# Altium schematic sheet CH555-R0-1v0.SchDoc
size 889 x 635 mm
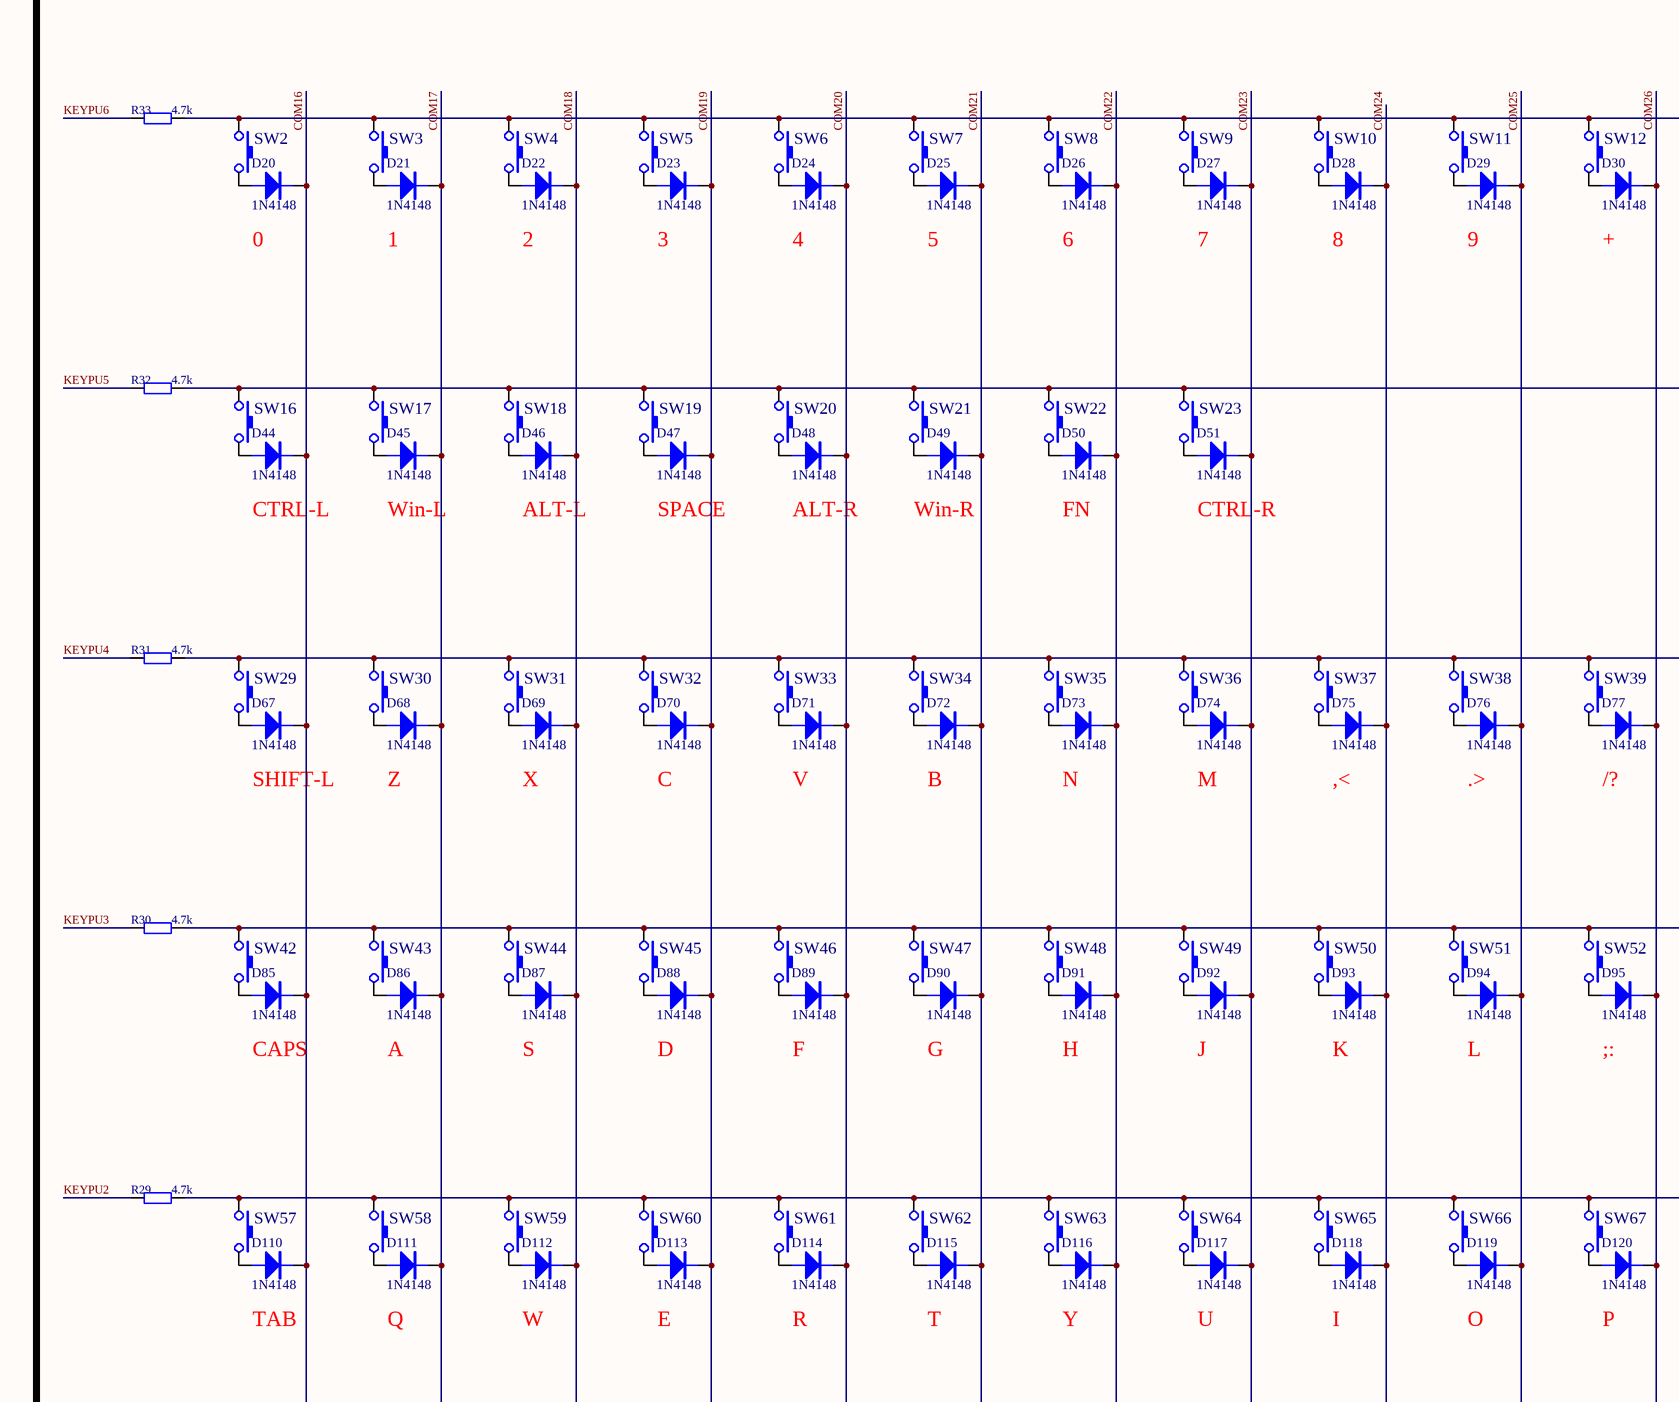
[diagram p0: CH555-R0-1v0.SchDoc, top left]
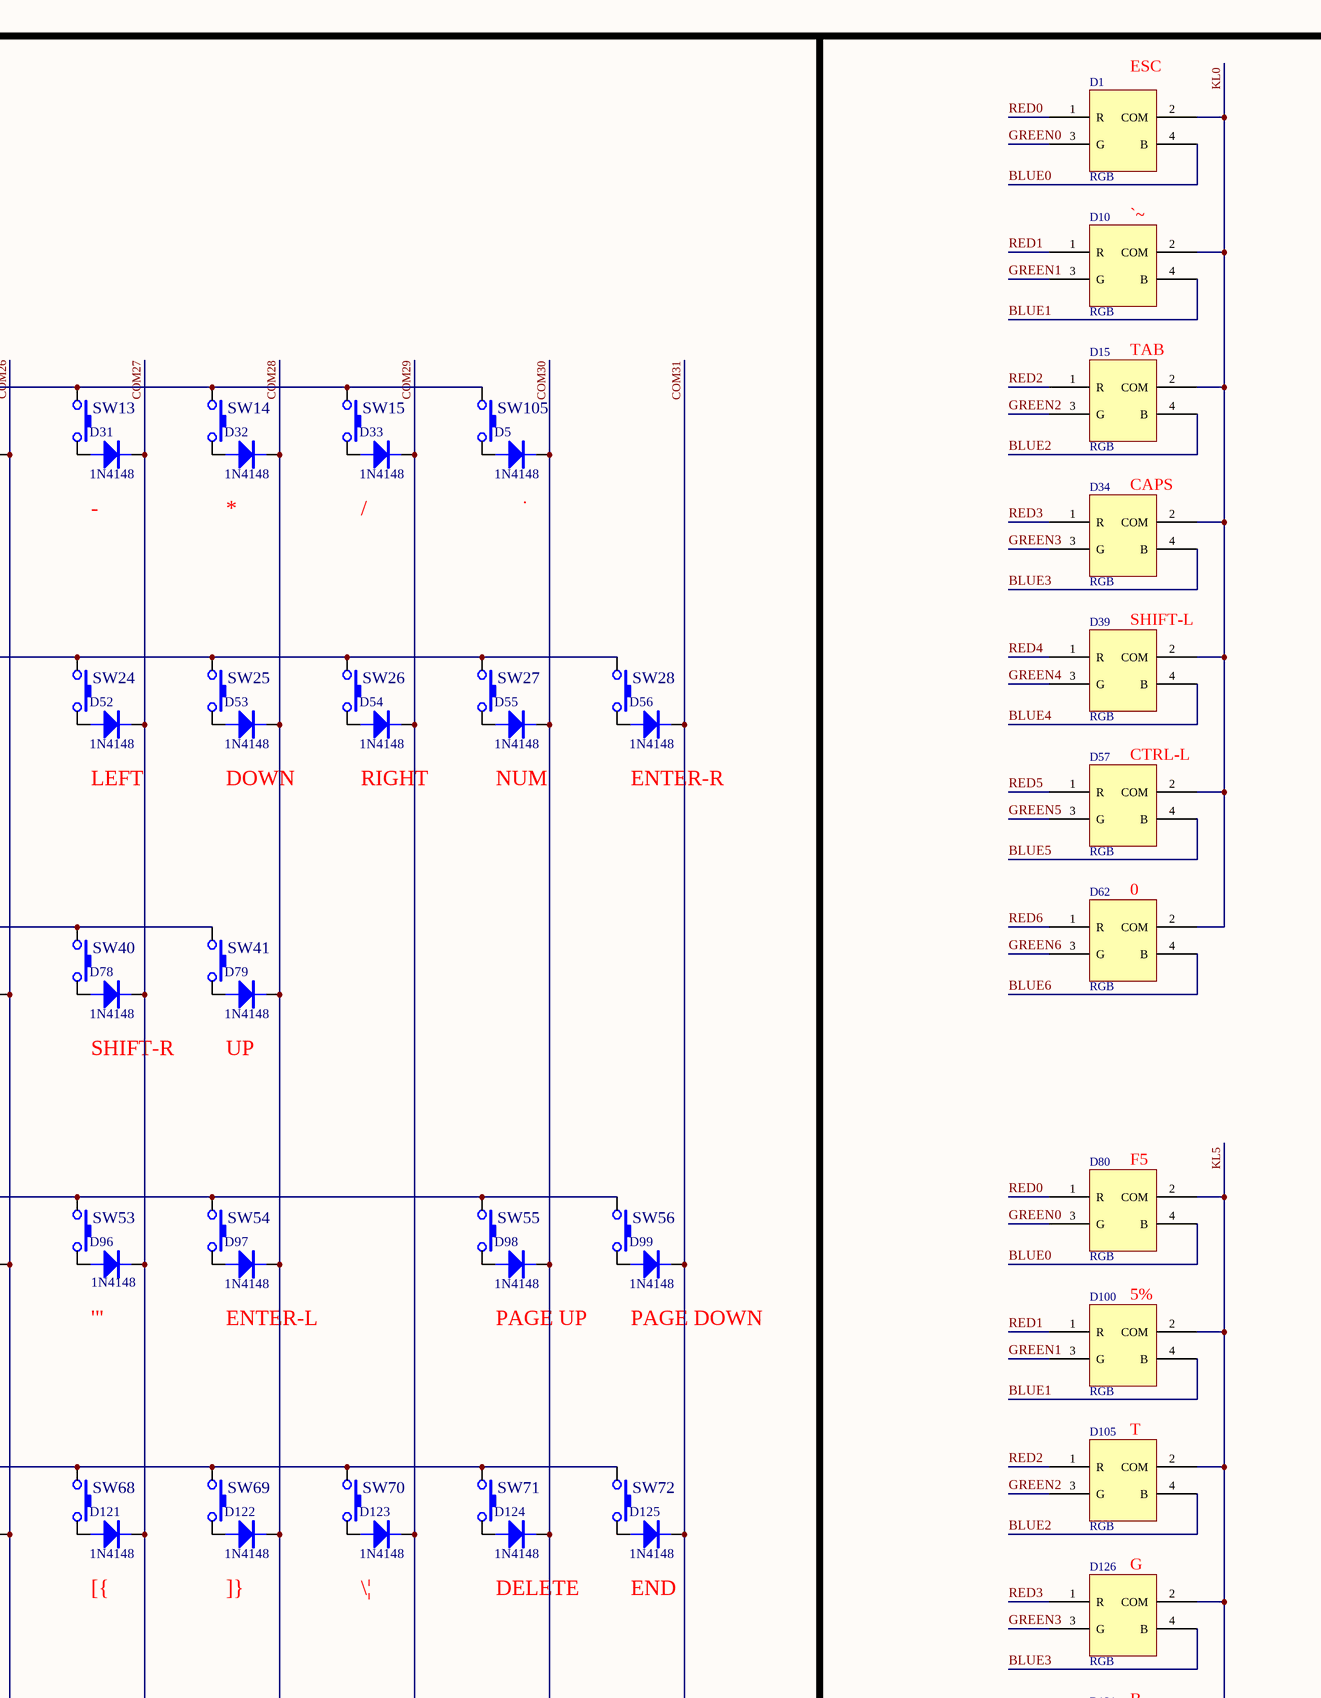
[diagram p1: CH555-R0-1v0.SchDoc, top middle]
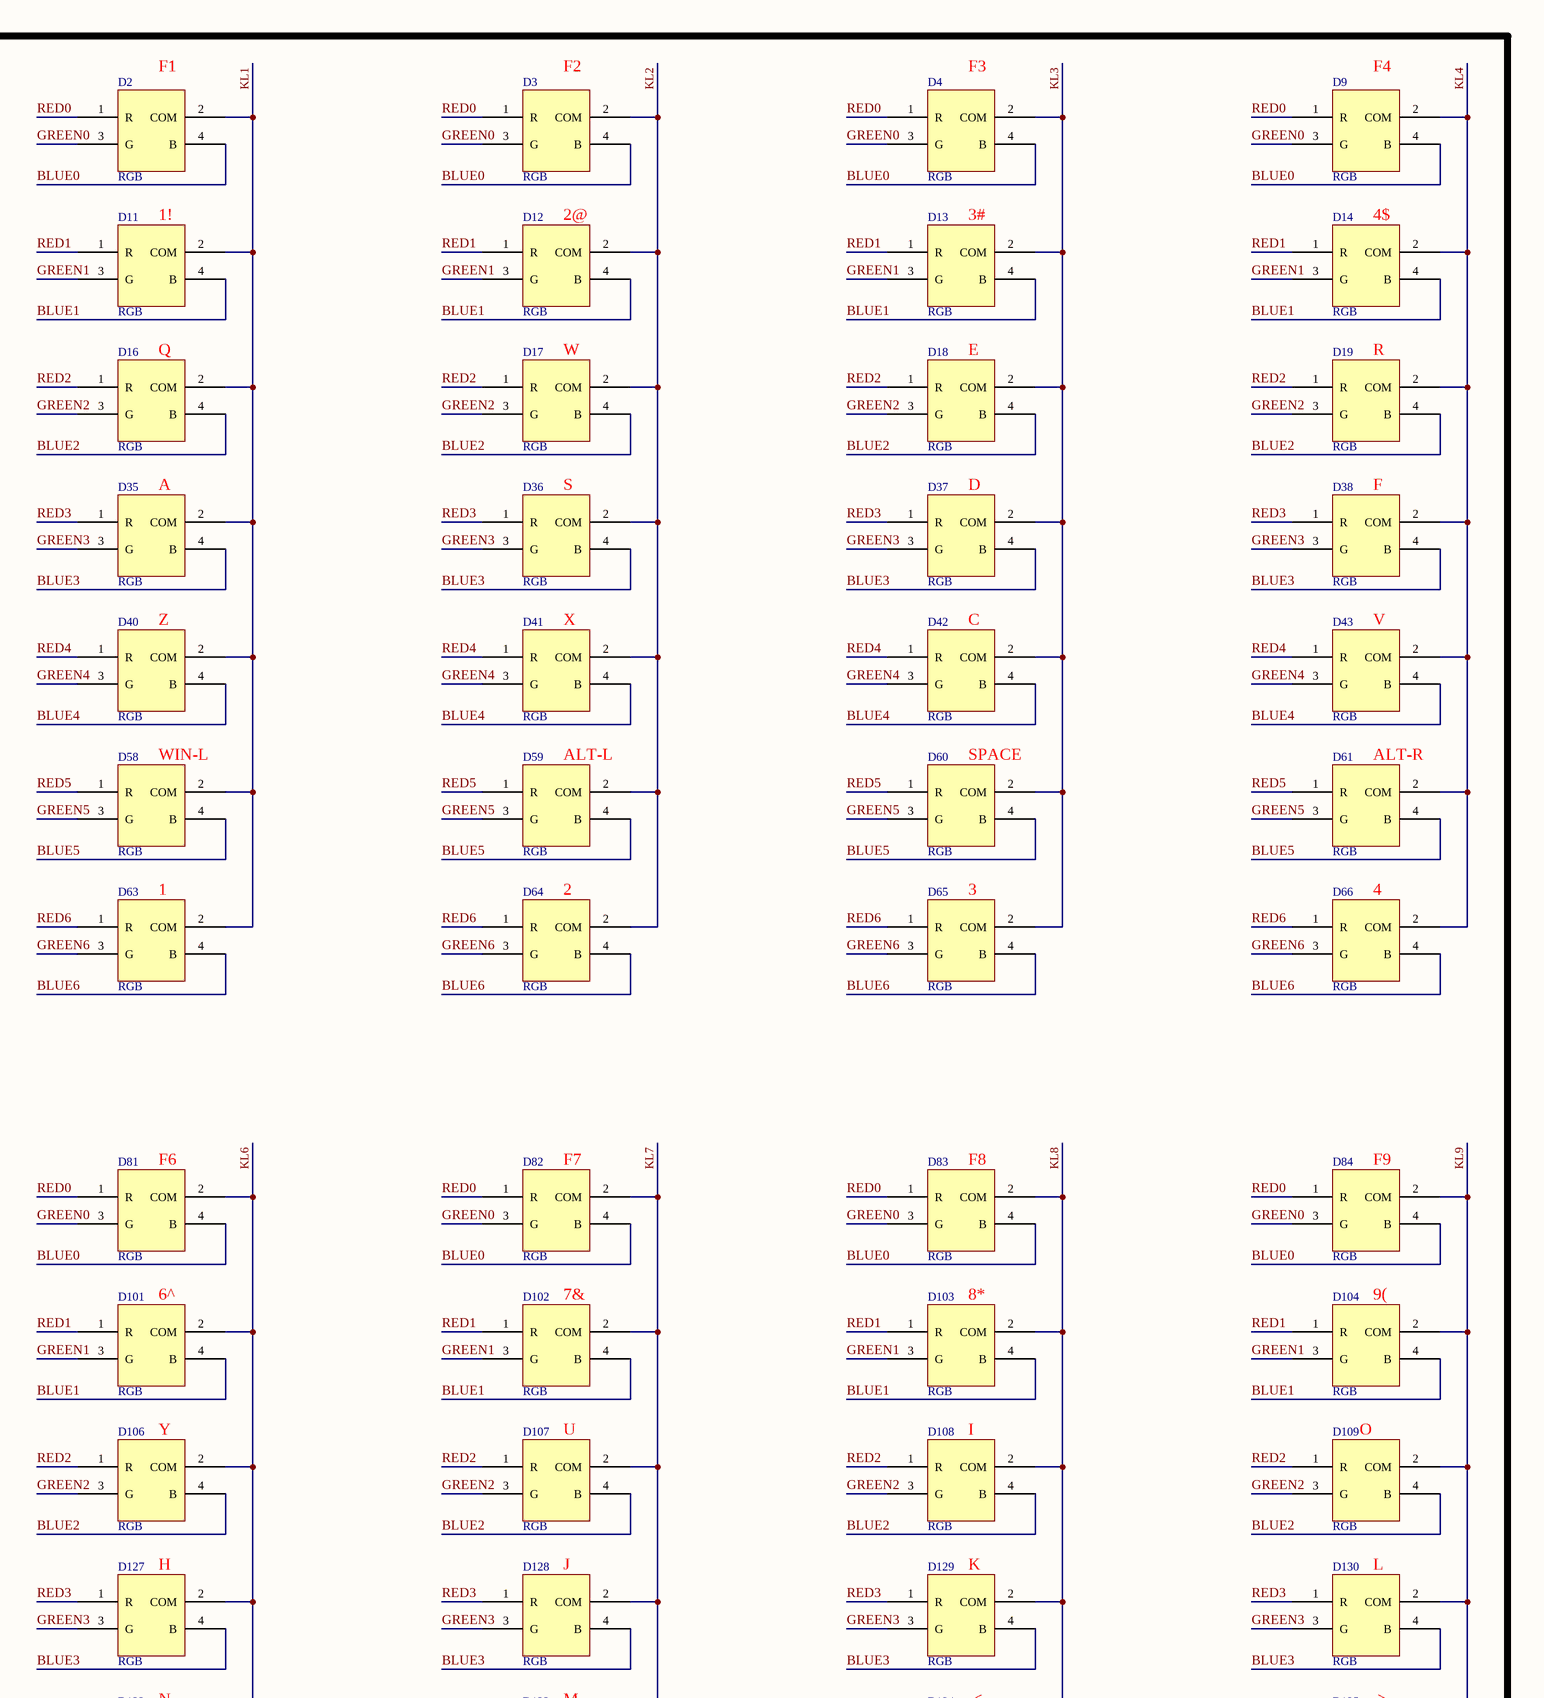
[diagram p2: CH555-R0-1v0.SchDoc, top right]
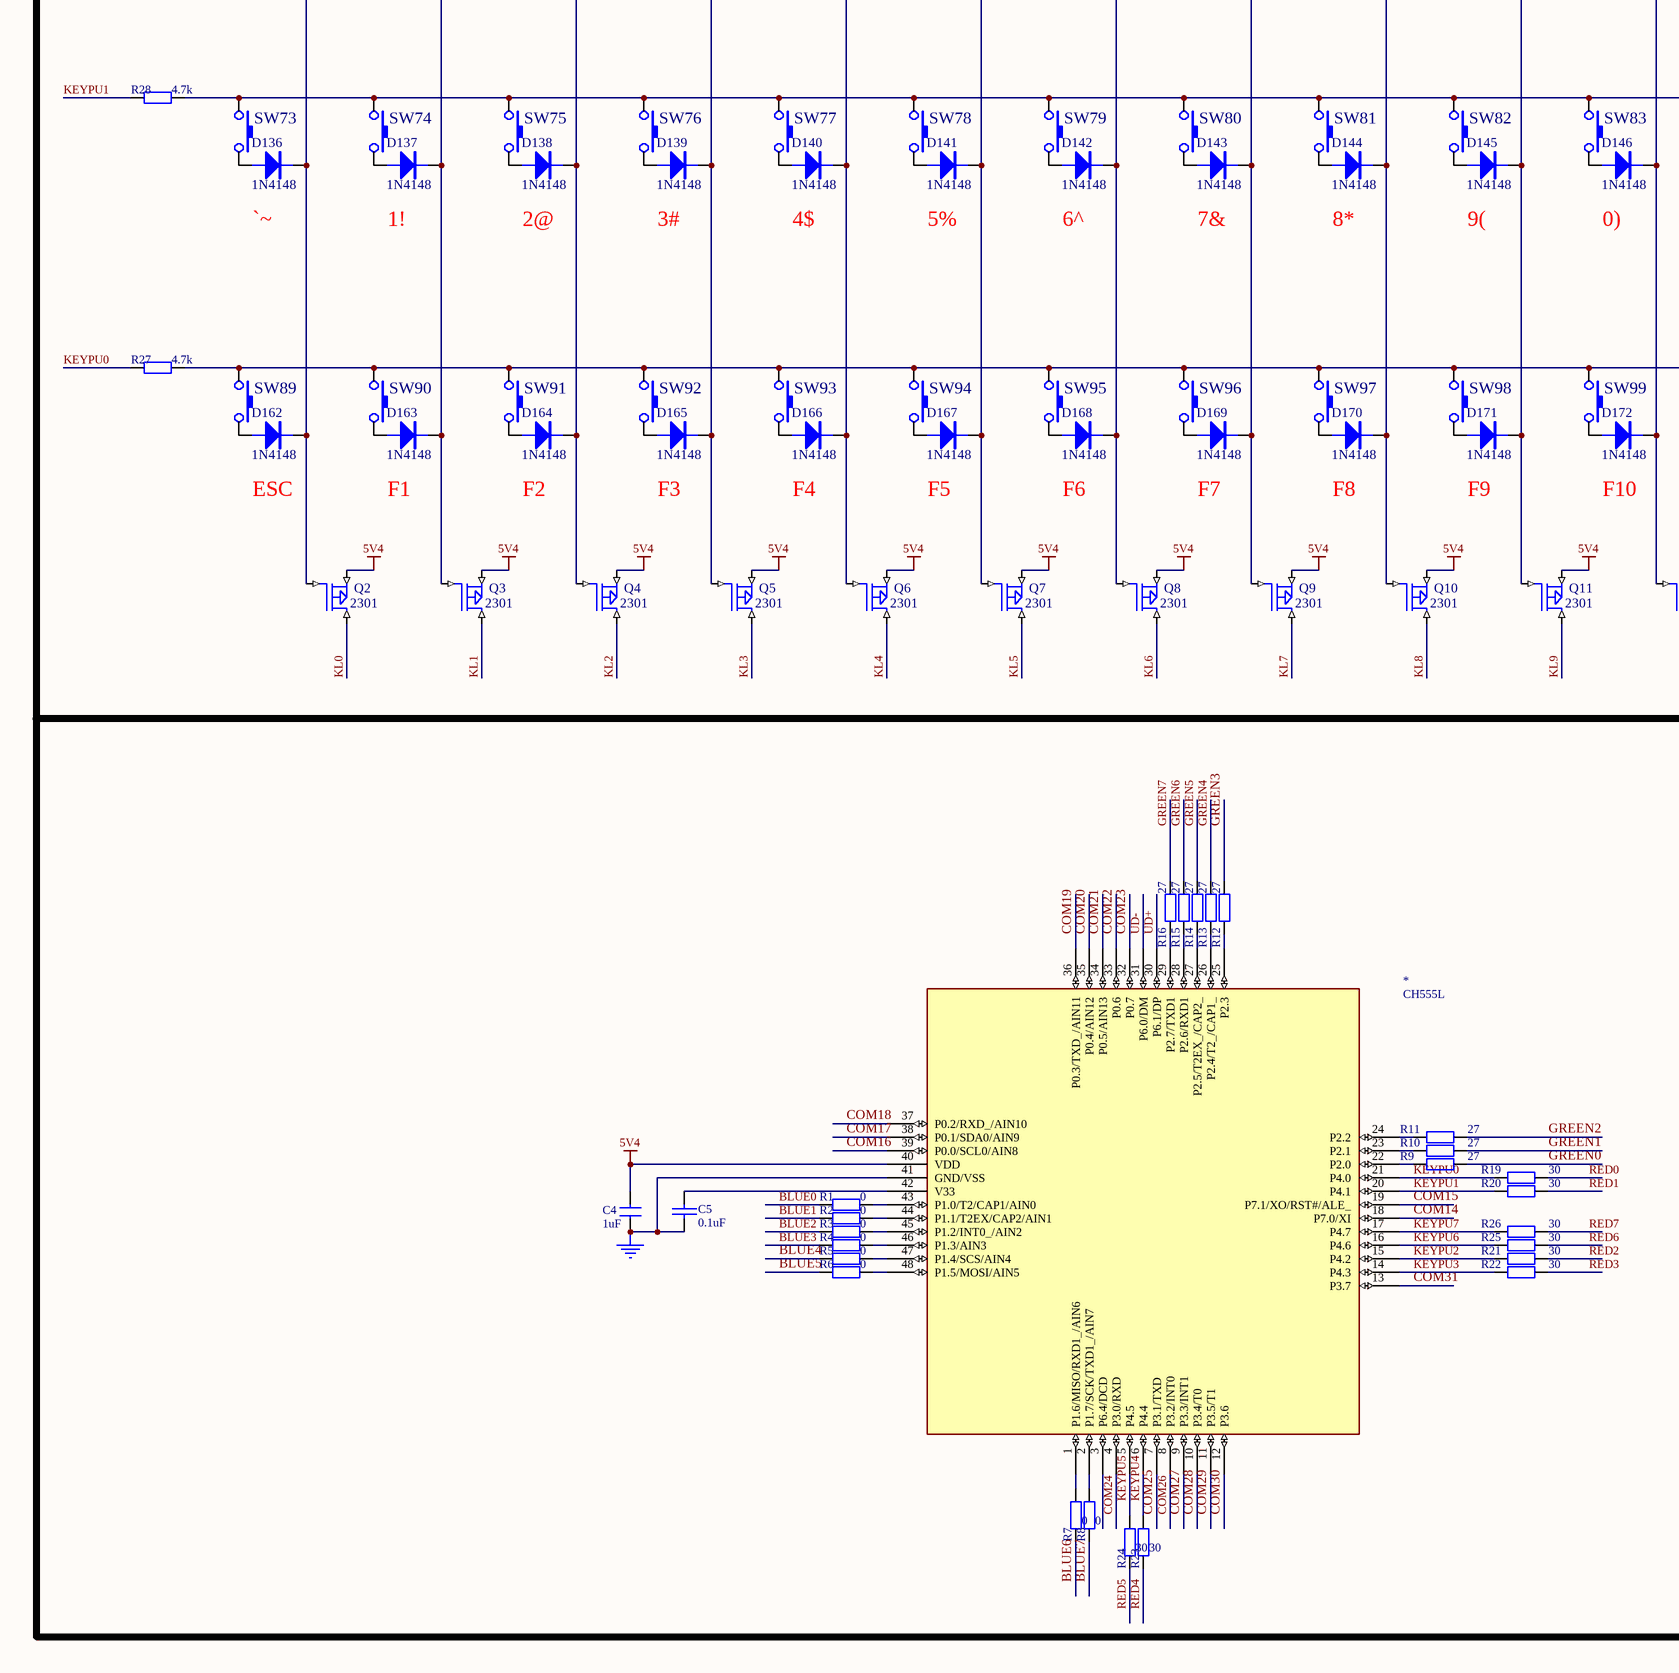
[diagram p3: CH555-R0-1v0.SchDoc, bottom left]
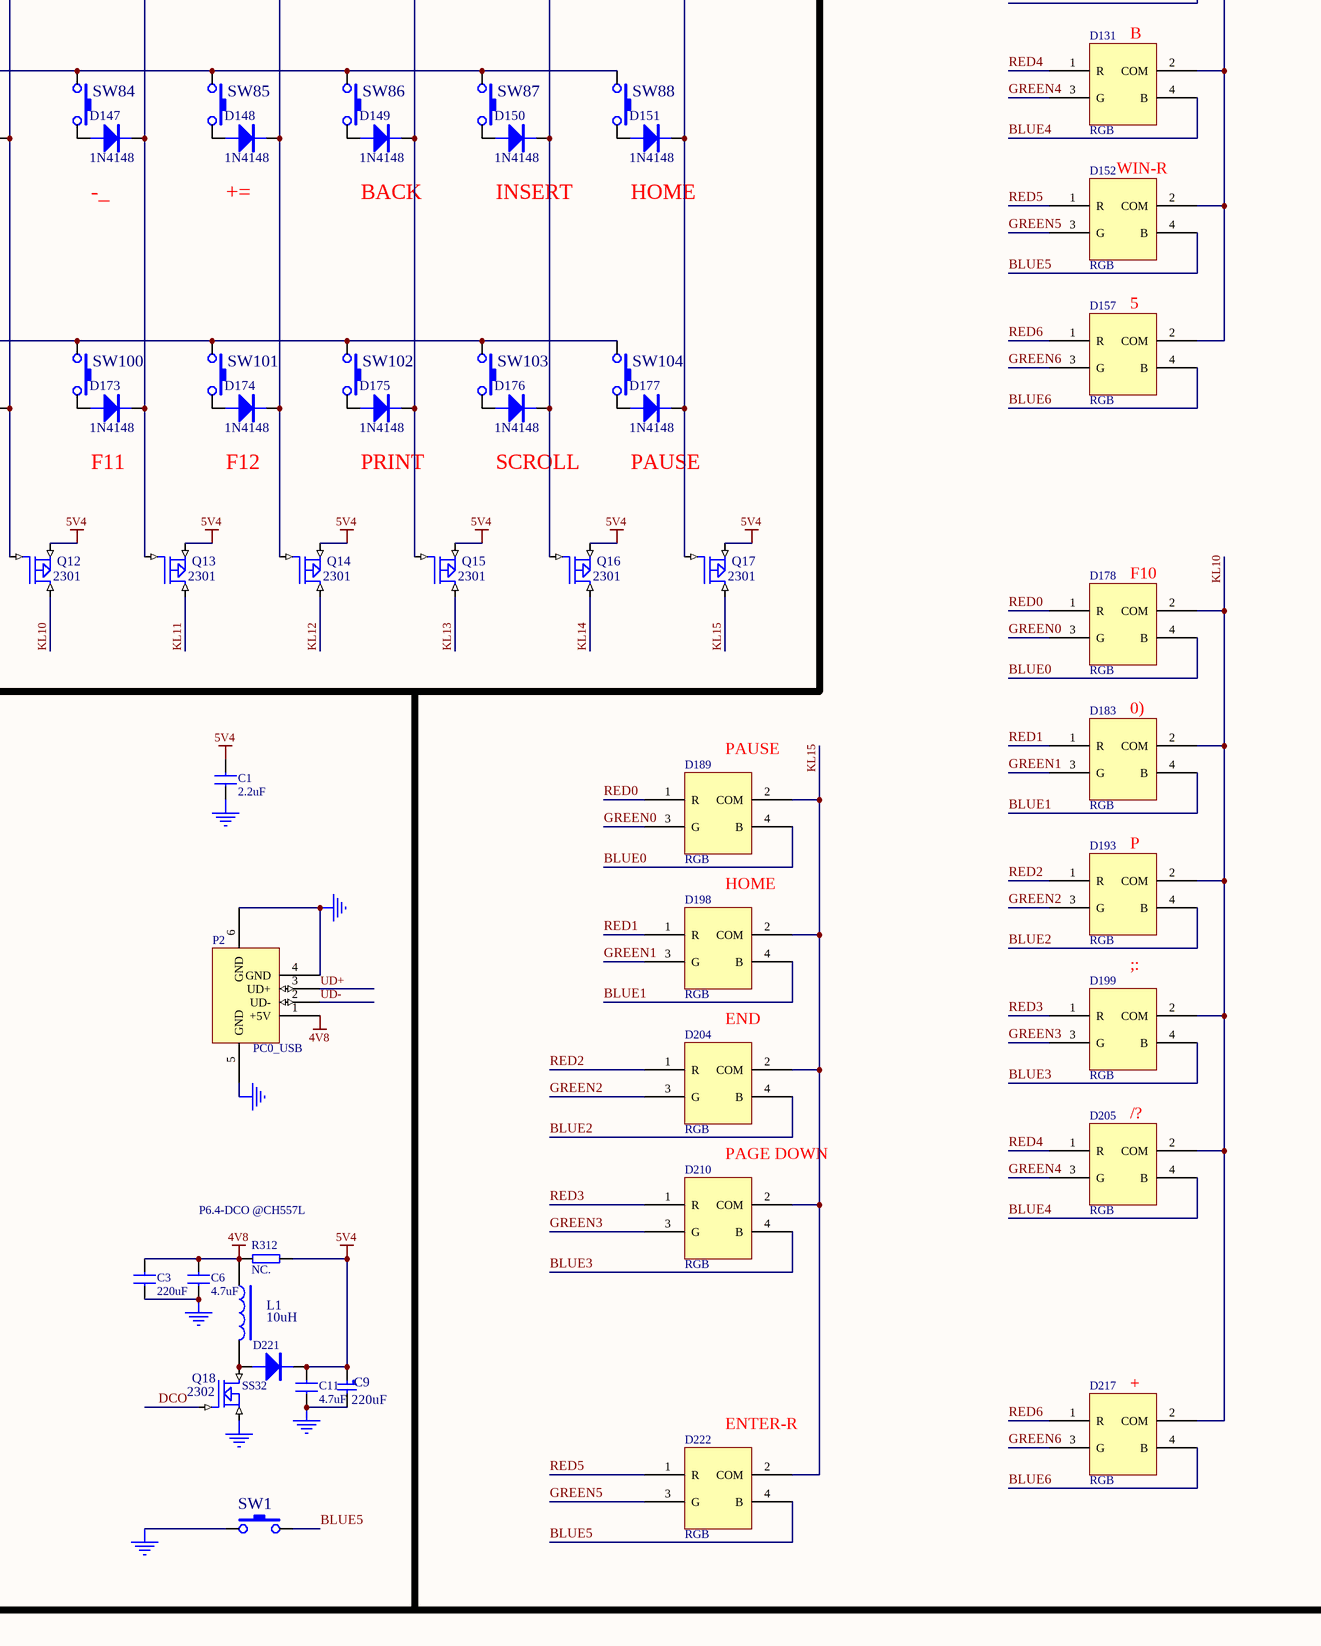
[diagram p4: CH555-R0-1v0.SchDoc, bottom middle]
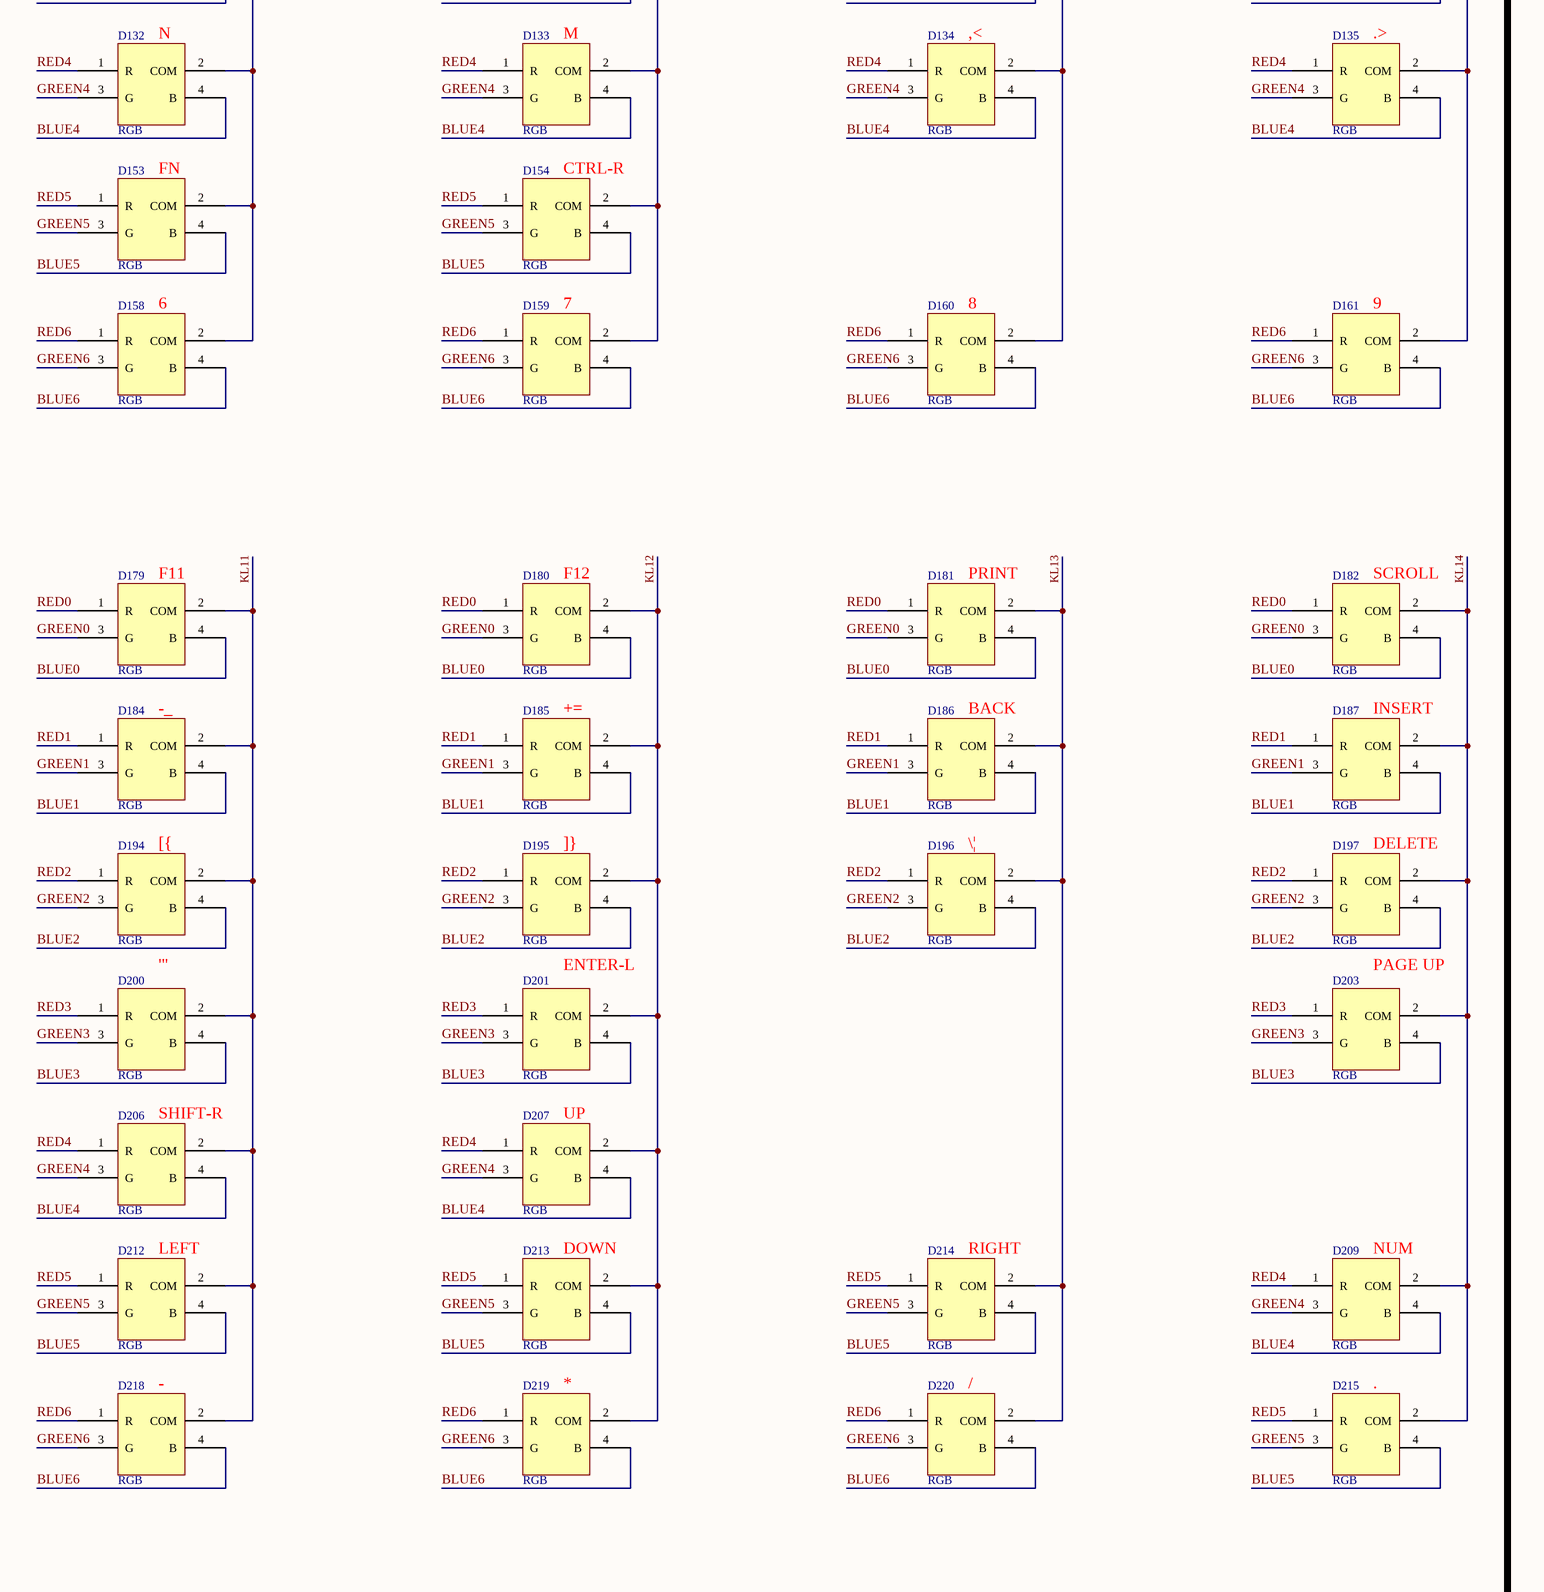
[diagram p5: CH555-R0-1v0.SchDoc, bottom right]

## Parts
*  CH555L
C1  2.2uF  [0603]
C3  value 220uF  [SMD_6.3x7.7mm]  (hidden comment: 2.2uF)
C4  1uF  [0603]
C5  0.1uF  [0603]
C6  value 4.7uF  [0603]  (hidden comment: 2.2uF)
C9  220uF  [SMD_6.3x7.7mm]
C11  value 4.7uF  [0603]  (hidden comment: 2.2uF)
D1  RGB  [RGB-2x5x5mm]
D2  RGB  [RGB-2x5x5mm]
D3  RGB  [RGB-2x5x5mm]
D4  RGB  [RGB-2x5x5mm]
D5  1N4148  [3216+]
D9  RGB  [RGB-2x5x5mm]
D10  RGB  [RGB-2x5x5mm]
D11  RGB  [RGB-2x5x5mm]
D12  RGB  [RGB-2x5x5mm]
D13  RGB  [RGB-2x5x5mm]
D14  RGB  [RGB-2x5x5mm]
D15  RGB  [RGB-2x5x5mm]
D16  RGB  [RGB-2x5x5mm]
D17  RGB  [RGB-2x5x5mm]
D18  RGB  [RGB-2x5x5mm]
D19  RGB  [RGB-2x5x5mm]
D20  1N4148  [3216+]
D21  1N4148  [3216+]
D22  1N4148  [3216+]
D23  1N4148  [3216+]
D24  1N4148  [3216+]
D25  1N4148  [3216+]
D26  1N4148  [3216+]
D27  1N4148  [3216+]
D28  1N4148  [3216+]
D29  1N4148  [3216+]
D30  1N4148  [3216+]
D31  1N4148  [3216+]
D32  1N4148  [3216+]
D33  1N4148  [3216+]
D34  RGB  [RGB-2x5x5mm]
D35  RGB  [RGB-2x5x5mm]
D36  RGB  [RGB-2x5x5mm]
D37  RGB  [RGB-2x5x5mm]
D38  RGB  [RGB-2x5x5mm]
D39  RGB  [RGB-2x5x5mm]
D40  RGB  [RGB-2x5x5mm]
D41  RGB  [RGB-2x5x5mm]
D42  RGB  [RGB-2x5x5mm]
D43  RGB  [RGB-2x5x5mm]
D44  1N4148  [3216+]
D45  1N4148  [3216+]
D46  1N4148  [3216+]
D47  1N4148  [3216+]
D48  1N4148  [3216+]
D49  1N4148  [3216+]
D50  1N4148  [3216+]
D51  1N4148  [3216+]
D52  1N4148  [3216+]
D53  1N4148  [3216+]
D54  1N4148  [3216+]
D55  1N4148  [3216+]
D56  1N4148  [3216+]
D57  RGB  [RGB-2x5x5mm]
D58  RGB  [RGB-2x5x5mm]
D59  RGB  [RGB-2x5x5mm]
D60  RGB  [RGB-2x5x5mm]
D61  RGB  [RGB-2x5x5mm]
D62  RGB  [RGB-2x5x5mm]
D63  RGB  [RGB-2x5x5mm]
D64  RGB  [RGB-2x5x5mm]
D65  RGB  [RGB-2x5x5mm]
D66  RGB  [RGB-2x5x5mm]
D67  1N4148  [3216+]
D68  1N4148  [3216+]
D69  1N4148  [3216+]
D70  1N4148  [3216+]
D71  1N4148  [3216+]
D72  1N4148  [3216+]
D73  1N4148  [3216+]
D74  1N4148  [3216+]
D75  1N4148  [3216+]
D76  1N4148  [3216+]
D77  1N4148  [3216+]
D78  1N4148  [3216+]
D79  1N4148  [3216+]
D80  RGB  [RGB-2x5x5mm]
D81  RGB  [RGB-2x5x5mm]
D82  RGB  [RGB-2x5x5mm]
D83  RGB  [RGB-2x5x5mm]
D84  RGB  [RGB-2x5x5mm]
D85  1N4148  [3216+]
D86  1N4148  [3216+]
D87  1N4148  [3216+]
D88  1N4148  [3216+]
D89  1N4148  [3216+]
D90  1N4148  [3216+]
D91  1N4148  [3216+]
D92  1N4148  [3216+]
D93  1N4148  [3216+]
D94  1N4148  [3216+]
D95  1N4148  [3216+]
D96  1N4148  [3216+]
D97  1N4148  [3216+]
D98  1N4148  [3216+]
D99  1N4148  [3216+]
D100  RGB  [RGB-2x5x5mm]
D101  RGB  [RGB-2x5x5mm]
D102  RGB  [RGB-2x5x5mm]
D103  RGB  [RGB-2x5x5mm]
D104  RGB  [RGB-2x5x5mm]
D105  RGB  [RGB-2x5x5mm]
D106  RGB  [RGB-2x5x5mm]
D107  RGB  [RGB-2x5x5mm]
D108  RGB  [RGB-2x5x5mm]
D109  RGB  [RGB-2x5x5mm]
D110  1N4148  [3216+]
D111  1N4148  [3216+]
D112  1N4148  [3216+]
D113  1N4148  [3216+]
D114  1N4148  [3216+]
D115  1N4148  [3216+]
D116  1N4148  [3216+]
D117  1N4148  [3216+]
D118  1N4148  [3216+]
D119  1N4148  [3216+]
D120  1N4148  [3216+]
D121  1N4148  [3216+]
D122  1N4148  [3216+]
D123  1N4148  [3216+]
D124  1N4148  [3216+]
D125  1N4148  [3216+]
D126  RGB  [RGB-2x5x5mm]
D127  RGB  [RGB-2x5x5mm]
D128  RGB  [RGB-2x5x5mm]
D129  RGB  [RGB-2x5x5mm]
D130  RGB  [RGB-2x5x5mm]
D131  RGB  [RGB-2x5x5mm]
D132  RGB  [RGB-2x5x5mm]
D133  RGB  [RGB-2x5x5mm]
D134  RGB  [RGB-2x5x5mm]
D135  RGB  [RGB-2x5x5mm]
D136  1N4148  [3216+]
D137  1N4148  [3216+]
D138  1N4148  [3216+]
D139  1N4148  [3216+]
D140  1N4148  [3216+]
D141  1N4148  [3216+]
D142  1N4148  [3216+]
D143  1N4148  [3216+]
D144  1N4148  [3216+]
D145  1N4148  [3216+]
D146  1N4148  [3216+]
D147  1N4148  [3216+]
D148  1N4148  [3216+]
D149  1N4148  [3216+]
D150  1N4148  [3216+]
D151  1N4148  [3216+]
D152  RGB  [RGB-2x5x5mm]
D153  RGB  [RGB-2x5x5mm]
D154  RGB  [RGB-2x5x5mm]
D157  RGB  [RGB-2x5x5mm]
D158  RGB  [RGB-2x5x5mm]
D159  RGB  [RGB-2x5x5mm]
D160  RGB  [RGB-2x5x5mm]
D161  RGB  [RGB-2x5x5mm]
D162  1N4148  [3216+]
D163  1N4148  [3216+]
D164  1N4148  [3216+]
D165  1N4148  [3216+]
D166  1N4148  [3216+]
D167  1N4148  [3216+]
D168  1N4148  [3216+]
D169  1N4148  [3216+]
D170  1N4148  [3216+]
D171  1N4148  [3216+]
D172  1N4148  [3216+]
D173  1N4148  [3216+]
D174  1N4148  [3216+]
D175  1N4148  [3216+]
D176  1N4148  [3216+]
D177  1N4148  [3216+]
D178  RGB  [RGB-2x5x5mm]
D179  RGB  [RGB-2x5x5mm]
D180  RGB  [RGB-2x5x5mm]
D181  RGB  [RGB-2x5x5mm]
D182  RGB  [RGB-2x5x5mm]
D183  RGB  [RGB-2x5x5mm]
D184  RGB  [RGB-2x5x5mm]
D185  RGB  [RGB-2x5x5mm]
D186  RGB  [RGB-2x5x5mm]
D187  RGB  [RGB-2x5x5mm]
D189  RGB  [RGB-2x5x5mm]
D193  RGB  [RGB-2x5x5mm]
D194  RGB  [RGB-2x5x5mm]
D195  RGB  [RGB-2x5x5mm]
D196  RGB  [RGB-2x5x5mm]
D197  RGB  [RGB-2x5x5mm]
D198  RGB  [RGB-2x5x5mm]
D199  RGB  [RGB-2x5x5mm]
D200  RGB  [RGB-2x5x5mm]
D201  RGB  [RGB-2x5x5mm]
D203  RGB  [RGB-2x5x5mm]
D204  RGB  [RGB-2x5x5mm]
D205  RGB  [RGB-2x5x5mm]
D206  RGB  [RGB-2x5x5mm]
D207  RGB  [RGB-2x5x5mm]
D209  RGB  [RGB-2x5x5mm]
D210  RGB  [RGB-2x5x5mm]
D212  RGB  [RGB-2x5x5mm]
D213  RGB  [RGB-2x5x5mm]
D214  RGB  [RGB-2x5x5mm]
D215  RGB  [RGB-2x5x5mm]
D217  RGB  [RGB-2x5x5mm]
D218  RGB  [RGB-2x5x5mm]
D219  RGB  [RGB-2x5x5mm]
D220  RGB  [RGB-2x5x5mm]
D221  SS32  [7227+]
D222  RGB  [RGB-2x5x5mm]
L1  10uH  [L3.3]
P2  PC0_USB  [USBA-L]
Q2  2301  [SOT23]
Q3  2301  [SOT23]
Q4  2301  [SOT23]
Q5  2301  [SOT23]
Q6  2301  [SOT23]
Q7  2301  [SOT23]
Q8  2301  [SOT23]
Q9  2301  [SOT23]
Q10  2301  [SOT23]
Q11  2301  [SOT23]
Q12  2301  [SOT23]
Q13  2301  [SOT23]
Q14  2301  [SOT23]
Q15  2301  [SOT23]
Q16  2301  [SOT23]
Q17  2301  [SOT23]
Q18  2302  [SOT23]
R1  0  [0603]
R2  0  [0603]
R3  0  [0603]
R4  0  [0603]
R5  0  [0603]
R6  0  [0603]
R7  0  [0603]
R8  0  [0603]
R9  27  [0603]
R10  27  [0603]
R11  27  [0603]
R12  27  [0603]
R13  27  [0603]
R14  27  [0603]
R15  27  [0603]
R16  27  [0603]
R19  30  [0603]
R20  30  [0603]
R21  30  [0603]
R22  30  [0603]
R23  30  [0603]
R24  30  [0603]
R25  30  [0603]
R26  30  [0603]
R27  4.7k  [0603]
R28  4.7k  [0603]
R29  4.7k  [0603]
R30  4.7k  [0603]
R31  4.7k  [0603]
R32  4.7k  [0603]
R33  4.7k  [0603]
R312  NC.  [0603]
SW1  (no value)  [SMD_6.1x3.65x2.5mm-KEY]
SW2  (no value)  [黑轴4.2mm]
SW3  (no value)  [黑轴4.2mm]
SW4  (no value)  [黑轴4.2mm]
SW5  (no value)  [黑轴4.2mm]
SW6  (no value)  [黑轴4.2mm]
SW7  (no value)  [黑轴4.2mm]
SW8  (no value)  [黑轴4.2mm]
SW9  (no value)  [黑轴4.2mm]
SW10  (no value)  [黑轴4.2mm]
SW11  (no value)  [黑轴4.2mm]
SW12  (no value)  [黑轴4.2mm]
SW13  (no value)  [黑轴4.2mm]
SW14  (no value)  [黑轴4.2mm]
SW15  (no value)  [黑轴4.2mm]
SW16  (no value)  [黑轴4.2mm]
SW17  (no value)  [黑轴4.2mm]
SW18  (no value)  [黑轴4.2mm]
SW19  (no value)  [黑轴4.2mm]
SW20  (no value)  [黑轴4.2mm]
SW21  (no value)  [黑轴4.2mm]
SW22  (no value)  [黑轴4.2mm]
SW23  (no value)  [黑轴4.2mm]
SW24  (no value)  [黑轴4.2mm]
SW25  (no value)  [黑轴4.2mm]
SW26  (no value)  [黑轴4.2mm]
SW27  (no value)  [黑轴4.2mm]
SW28  (no value)  [黑轴4.2mm]
SW29  (no value)  [黑轴4.2mm]
SW30  (no value)  [黑轴4.2mm]
SW31  (no value)  [黑轴4.2mm]
SW32  (no value)  [黑轴4.2mm]
SW33  (no value)  [黑轴4.2mm]
SW34  (no value)  [黑轴4.2mm]
SW35  (no value)  [黑轴4.2mm]
SW36  (no value)  [黑轴4.2mm]
SW37  (no value)  [黑轴4.2mm]
SW38  (no value)  [黑轴4.2mm]
SW39  (no value)  [黑轴4.2mm]
SW40  (no value)  [黑轴4.2mm]
SW41  (no value)  [黑轴4.2mm]
SW42  (no value)  [黑轴4.2mm]
SW43  (no value)  [黑轴4.2mm]
SW44  (no value)  [黑轴4.2mm]
SW45  (no value)  [黑轴4.2mm]
SW46  (no value)  [黑轴4.2mm]
SW47  (no value)  [黑轴4.2mm]
SW48  (no value)  [黑轴4.2mm]
SW49  (no value)  [黑轴4.2mm]
SW50  (no value)  [黑轴4.2mm]
SW51  (no value)  [黑轴4.2mm]
SW52  (no value)  [黑轴4.2mm]
SW53  (no value)  [黑轴4.2mm]
SW54  (no value)  [黑轴4.2mm]
SW55  (no value)  [黑轴4.2mm]
SW56  (no value)  [黑轴4.2mm]
SW57  (no value)  [黑轴4.2mm]
SW58  (no value)  [黑轴4.2mm]
SW59  (no value)  [黑轴4.2mm]
SW60  (no value)  [黑轴4.2mm]
SW61  (no value)  [黑轴4.2mm]
SW62  (no value)  [黑轴4.2mm]
SW63  (no value)  [黑轴4.2mm]
SW64  (no value)  [黑轴4.2mm]
SW65  (no value)  [黑轴4.2mm]
SW66  (no value)  [黑轴4.2mm]
SW67  (no value)  [黑轴4.2mm]
SW68  (no value)  [黑轴4.2mm]
SW69  (no value)  [黑轴4.2mm]
SW70  (no value)  [黑轴4.2mm]
SW71  (no value)  [黑轴4.2mm]
SW72  (no value)  [黑轴4.2mm]
SW73  (no value)  [黑轴4.2mm]
SW74  (no value)  [黑轴4.2mm]
SW75  (no value)  [黑轴4.2mm]
SW76  (no value)  [黑轴4.2mm]
SW77  (no value)  [黑轴4.2mm]
SW78  (no value)  [黑轴4.2mm]
SW79  (no value)  [黑轴4.2mm]
SW80  (no value)  [黑轴4.2mm]
SW81  (no value)  [黑轴4.2mm]
SW82  (no value)  [黑轴4.2mm]
SW83  (no value)  [黑轴4.2mm]
SW84  (no value)  [黑轴4.2mm]
SW85  (no value)  [黑轴4.2mm]
SW86  (no value)  [黑轴4.2mm]
SW87  (no value)  [黑轴4.2mm]
SW88  (no value)  [黑轴4.2mm]
SW89  (no value)  [黑轴4.2mm]
SW90  (no value)  [黑轴4.2mm]
SW91  (no value)  [黑轴4.2mm]
SW92  (no value)  [黑轴4.2mm]
SW93  (no value)  [黑轴4.2mm]
SW94  (no value)  [黑轴4.2mm]
SW95  (no value)  [黑轴4.2mm]
SW96  (no value)  [黑轴4.2mm]
SW97  (no value)  [黑轴4.2mm]
SW98  (no value)  [黑轴4.2mm]
SW99  (no value)  [黑轴4.2mm]
SW100  (no value)  [黑轴4.2mm]
SW101  (no value)  [黑轴4.2mm]
SW102  (no value)  [黑轴4.2mm]
SW103  (no value)  [黑轴4.2mm]
SW104  (no value)  [黑轴4.2mm]
SW105  (no value)  [黑轴4.2mm]

## Nets
4V8: C3.1 C6.1 L1.1 P2.1(+5V) R312.1
5V4: *.40(VDD) C1.1 C4.1 C9.1 C11.1 D221.2(K) Q2.2(S) Q3.2(S) Q4.2(S) Q5.2(S) Q6.2(S) Q7.2(S) Q8.2(S) Q9.2(S) Q10.2(S) Q11.2(S) Q12.2(S) Q13.2(S) Q14.2(S) Q15.2(S) Q16.2(S) Q17.2(S) R312.2
GND: *.41(GND/VSS) C1.2 C3.2 C4.2 C5.2 C6.2 C9.2 C11.2 P2.4(GND) P2.5(GND) P2.6(GND) Q18.2(S) SW1.2
BLUE0: D1.4(B) D2.4(B) D3.4(B) D4.4(B) D9.4(B) D80.4(B) D81.4(B) D82.4(B) D83.4(B) D84.4(B) D178.4(B) D179.4(B) D180.4(B) D181.4(B) D182.4(B) D189.4(B) R1.1
BLUE1: D10.4(B) D11.4(B) D12.4(B) D13.4(B) D14.4(B) D100.4(B) D101.4(B) D102.4(B) D103.4(B) D104.4(B) D183.4(B) D184.4(B) D185.4(B) D186.4(B) D187.4(B) D198.4(B) R2.1
BLUE2: D15.4(B) D16.4(B) D17.4(B) D18.4(B) D19.4(B) D105.4(B) D106.4(B) D107.4(B) D108.4(B) D109.4(B) D193.4(B) D194.4(B) D195.4(B) D196.4(B) D197.4(B) D204.4(B) R3.1
BLUE3: D34.4(B) D35.4(B) D36.4(B) D37.4(B) D38.4(B) D126.4(B) D127.4(B) D128.4(B) D129.4(B) D130.4(B) D199.4(B) D200.4(B) D201.4(B) D203.4(B) D210.4(B) R4.1
BLUE4: D39.4(B) D40.4(B) D41.4(B) D42.4(B) D43.4(B) D131.4(B) D132.4(B) D133.4(B) D134.4(B) D135.4(B) D205.4(B) D206.4(B) D207.4(B) D209.4(B) R5.1
BLUE5: D57.4(B) D58.4(B) D59.4(B) D60.4(B) D61.4(B) D152.4(B) D153.4(B) D154.4(B) D212.4(B) D213.4(B) D214.4(B) D215.4(B) D222.4(B) R6.1 SW1.1
BLUE6: D62.4(B) D63.4(B) D64.4(B) D65.4(B) D66.4(B) D157.4(B) D158.4(B) D159.4(B) D160.4(B) D161.4(B) D217.4(B) D218.4(B) D219.4(B) D220.4(B) R7.2
BLUE7: R8.1
COM14: *.18(P7.0/XI)
COM15: *.19(P7.1/XO/RST#/ALE_)
COM16: *.39(P0.0/SCL0/AIN8) D20.2(K) D44.2(K) D67.2(K) D85.2(K) D110.2(K) D136.2(K) D162.2(K) Q2.1(G)
COM17: *.38(P0.1/SDA0/AIN9) D21.2(K) D45.2(K) D68.2(K) D86.2(K) D111.2(K) D137.2(K) D163.2(K) Q3.1(G)
COM18: *.37(P0.2/RXD_/AIN10) D22.2(K) D46.2(K) D69.2(K) D87.2(K) D112.2(K) D138.2(K) D164.2(K) Q4.1(G)
COM19: *.36(P0.3/TXD_/AIN11) D23.2(K) D47.2(K) D70.2(K) D88.2(K) D113.2(K) D139.2(K) D165.2(K) Q5.1(G)
COM20: *.35(P0.4/AIN12) D24.2(K) D48.2(K) D71.2(K) D89.2(K) D114.2(K) D140.2(K) D166.2(K) Q6.1(G)
COM21: *.34(P0.5/AIN13) D25.2(K) D49.2(K) D72.2(K) D90.2(K) D115.2(K) D141.2(K) D167.2(K) Q7.1(G)
COM22: *.33(P0.6) D26.2(K) D50.2(K) D73.2(K) D91.2(K) D116.2(K) D142.2(K) D168.2(K) Q8.1(G)
COM23: *.32(P0.7) D27.2(K) D51.2(K) D74.2(K) D92.2(K) D117.2(K) D143.2(K) D169.2(K) Q9.1(G)
COM24: *.4(P3.0/RXD) D28.2(K) D75.2(K) D93.2(K) D118.2(K) D144.2(K) D170.2(K) Q10.1(G)
COM25: *.7(P3.1/TXD) D29.2(K) D76.2(K) D94.2(K) D119.2(K) D145.2(K) D171.2(K) Q11.1(G)
COM26: *.8(P3.2/INT0) D30.2(K) D77.2(K) D95.2(K) D120.2(K) D146.2(K) D172.2(K) Q12.1(G)
COM27: *.9(P3.3/INT1) D31.2(K) D52.2(K) D78.2(K) D96.2(K) D121.2(K) D147.2(K) D173.2(K) Q13.1(G)
COM28: *.10(P3.4/T0) D32.2(K) D53.2(K) D79.2(K) D97.2(K) D122.2(K) D148.2(K) D174.2(K) Q14.1(G)
COM29: *.11(P3.5/T1) D33.2(K) D54.2(K) D123.2(K) D149.2(K) D175.2(K) Q15.1(G)
COM30: *.12(P3.6) D5.2(K) D55.2(K) D98.2(K) D124.2(K) D150.2(K) D176.2(K) Q16.1(G)
COM31: *.13(P3.7) D56.2(K) D99.2(K) D125.2(K) D151.2(K) D177.2(K) Q17.1(G)
DCO: Q18.1(G)
GREEN0: D1.3(G) D2.3(G) D3.3(G) D4.3(G) D9.3(G) D80.3(G) D81.3(G) D82.3(G) D83.3(G) D84.3(G) D178.3(G) D179.3(G) D180.3(G) D181.3(G) D182.3(G) D189.3(G) R9.2
GREEN1: D10.3(G) D11.3(G) D12.3(G) D13.3(G) D14.3(G) D100.3(G) D101.3(G) D102.3(G) D103.3(G) D104.3(G) D183.3(G) D184.3(G) D185.3(G) D186.3(G) D187.3(G) D198.3(G) R10.2
GREEN2: D15.3(G) D16.3(G) D17.3(G) D18.3(G) D19.3(G) D105.3(G) D106.3(G) D107.3(G) D108.3(G) D109.3(G) D193.3(G) D194.3(G) D195.3(G) D196.3(G) D197.3(G) D204.3(G) R11.2
GREEN3: D34.3(G) D35.3(G) D36.3(G) D37.3(G) D38.3(G) D126.3(G) D127.3(G) D128.3(G) D129.3(G) D130.3(G) D199.3(G) D200.3(G) D201.3(G) D203.3(G) D210.3(G) R12.2
GREEN4: D39.3(G) D40.3(G) D41.3(G) D42.3(G) D43.3(G) D131.3(G) D132.3(G) D133.3(G) D134.3(G) D135.3(G) D205.3(G) D206.3(G) D207.3(G) D209.3(G) R13.2
GREEN5: D57.3(G) D58.3(G) D59.3(G) D60.3(G) D61.3(G) D152.3(G) D153.3(G) D154.3(G) D212.3(G) D213.3(G) D214.3(G) D215.3(G) D222.3(G) R14.2
GREEN6: D62.3(G) D63.3(G) D64.3(G) D65.3(G) D66.3(G) D157.3(G) D158.3(G) D159.3(G) D160.3(G) D161.3(G) D217.3(G) D218.3(G) D219.3(G) D220.3(G) R15.2
GREEN7: R16.2
KEYPU0: *.21(P4.0) R19.1 R27.1
KEYPU1: *.20(P4.1) R20.1 R28.1
KEYPU2: *.15(P4.2) R21.1 R29.1
KEYPU3: *.14(P4.3) R22.1 R30.1
KEYPU4: *.6(P4.4) R23.1 R31.1
KEYPU5: *.5(P4.5) R24.1 R32.1
KEYPU6: *.16(P4.6) R25.1 R33.1
KEYPU7: *.17(P4.7) R26.1
KL0: D1.2(COM) D10.2(COM) D15.2(COM) D34.2(COM) D39.2(COM) D57.2(COM) D62.2(COM) Q2.3(D)
KL1: D2.2(COM) D11.2(COM) D16.2(COM) D35.2(COM) D40.2(COM) D58.2(COM) D63.2(COM) Q3.3(D)
KL2: D3.2(COM) D12.2(COM) D17.2(COM) D36.2(COM) D41.2(COM) D59.2(COM) D64.2(COM) Q4.3(D)
KL3: D4.2(COM) D13.2(COM) D18.2(COM) D37.2(COM) D42.2(COM) D60.2(COM) D65.2(COM) Q5.3(D)
KL4: D9.2(COM) D14.2(COM) D19.2(COM) D38.2(COM) D43.2(COM) D61.2(COM) D66.2(COM) Q6.3(D)
KL5: D80.2(COM) D100.2(COM) D105.2(COM) D126.2(COM) D131.2(COM) D152.2(COM) D157.2(COM) Q7.3(D)
KL6: D81.2(COM) D101.2(COM) D106.2(COM) D127.2(COM) D132.2(COM) D153.2(COM) D158.2(COM) Q8.3(D)
KL7: D82.2(COM) D102.2(COM) D107.2(COM) D128.2(COM) D133.2(COM) D154.2(COM) D159.2(COM) Q9.3(D)
KL8: D83.2(COM) D103.2(COM) D108.2(COM) D129.2(COM) D134.2(COM) D160.2(COM) Q10.3(D)
KL9: D84.2(COM) D104.2(COM) D109.2(COM) D130.2(COM) D135.2(COM) D161.2(COM) Q11.3(D)
KL10: D178.2(COM) D183.2(COM) D193.2(COM) D199.2(COM) D205.2(COM) D217.2(COM) Q12.3(D)
KL11: D179.2(COM) D184.2(COM) D194.2(COM) D200.2(COM) D206.2(COM) D212.2(COM) D218.2(COM) Q13.3(D)
KL12: D180.2(COM) D185.2(COM) D195.2(COM) D201.2(COM) D207.2(COM) D213.2(COM) D219.2(COM) Q14.3(D)
KL13: D181.2(COM) D186.2(COM) D196.2(COM) D214.2(COM) D220.2(COM) Q15.3(D)
KL14: D182.2(COM) D187.2(COM) D197.2(COM) D203.2(COM) D209.2(COM) D215.2(COM) Q16.3(D)
KL15: D189.2(COM) D198.2(COM) D204.2(COM) D210.2(COM) D222.2(COM) Q17.3(D)
RED0: D1.1(R) D2.1(R) D3.1(R) D4.1(R) D9.1(R) D80.1(R) D81.1(R) D82.1(R) D83.1(R) D84.1(R) D178.1(R) D179.1(R) D180.1(R) D181.1(R) D182.1(R) D189.1(R) R19.2
RED1: D10.1(R) D11.1(R) D12.1(R) D13.1(R) D14.1(R) D100.1(R) D101.1(R) D102.1(R) D103.1(R) D104.1(R) D183.1(R) D184.1(R) D185.1(R) D186.1(R) D187.1(R) D198.1(R) R20.2
RED2: D15.1(R) D16.1(R) D17.1(R) D18.1(R) D19.1(R) D105.1(R) D106.1(R) D107.1(R) D108.1(R) D109.1(R) D193.1(R) D194.1(R) D195.1(R) D196.1(R) D197.1(R) D204.1(R) R21.2
RED3: D34.1(R) D35.1(R) D36.1(R) D37.1(R) D38.1(R) D126.1(R) D127.1(R) D128.1(R) D129.1(R) D130.1(R) D199.1(R) D200.1(R) D201.1(R) D203.1(R) D210.1(R) R22.2
RED4: D39.1(R) D40.1(R) D41.1(R) D42.1(R) D43.1(R) D131.1(R) D132.1(R) D133.1(R) D134.1(R) D135.1(R) D205.1(R) D206.1(R) D207.1(R) D209.1(R) R23.2
RED5: D57.1(R) D58.1(R) D59.1(R) D60.1(R) D61.1(R) D152.1(R) D153.1(R) D154.1(R) D212.1(R) D213.1(R) D214.1(R) D215.1(R) D222.1(R) R24.2
RED6: D62.1(R) D63.1(R) D64.1(R) D65.1(R) D66.1(R) D157.1(R) D158.1(R) D159.1(R) D160.1(R) D161.1(R) D217.1(R) D218.1(R) D219.1(R) D220.1(R) R25.2
RED7: R26.2
UD+: *.30(P6.1/DP) P2.3(UD+)
UD-: *.31(P6.0/DM) P2.2(UD-)
Net*_1: *.1(P1.6/MISO/RXD1_/AIN6) R7.1
Net*_2: *.2(P1.7/SCK/TXD1_/AIN7) R8.2
Net*_22: *.22(P2.0) R9.1
Net*_23: *.23(P2.1) R10.1
Net*_24: *.24(P2.2) R11.1
Net*_25: *.25(P2.3) R12.1
Net*_26: *.26(P2.4/T2_/CAP1_) R13.1
Net*_27: *.27(P2.5/T2EX_/CAP2_) R14.1
Net*_28: *.28(P2.6/RXD1) R15.1
Net*_29: *.29(P2.7/TXD1) R16.1
Net*_42: *.42(V33) C5.1
Net*_43: *.43(P1.0/T2/CAP1/AIN0) R1.2
Net*_44: *.44(P1.1/T2EX/CAP2/AIN1) R2.2
Net*_45: *.45(P1.2/INT0_/AIN2) R3.2
Net*_46: *.46(P1.3/AIN3) R4.2
Net*_47: *.47(P1.4/SCS/AIN4) R5.2
Net*_48: *.48(P1.5/MOSI/AIN5) R6.2
NetD5_1: D5.1(A) SW105.1
NetD20_1: D20.1(A) SW2.1
NetD21_1: D21.1(A) SW3.1
NetD22_1: D22.1(A) SW4.1
NetD23_1: D23.1(A) SW5.1
NetD24_1: D24.1(A) SW6.1
NetD25_1: D25.1(A) SW7.1
NetD26_1: D26.1(A) SW8.1
NetD27_1: D27.1(A) SW9.1
NetD28_1: D28.1(A) SW10.1
NetD29_1: D29.1(A) SW11.1
NetD30_1: D30.1(A) SW12.1
NetD31_1: D31.1(A) SW13.1
NetD32_1: D32.1(A) SW14.1
NetD33_1: D33.1(A) SW15.1
NetD44_1: D44.1(A) SW16.1
NetD45_1: D45.1(A) SW17.1
NetD46_1: D46.1(A) SW18.1
NetD47_1: D47.1(A) SW19.1
NetD48_1: D48.1(A) SW20.1
NetD49_1: D49.1(A) SW21.1
NetD50_1: D50.1(A) SW22.1
NetD51_1: D51.1(A) SW23.1
NetD52_1: D52.1(A) SW24.1
NetD53_1: D53.1(A) SW25.1
NetD54_1: D54.1(A) SW26.1
NetD55_1: D55.1(A) SW27.1
NetD56_1: D56.1(A) SW28.1
NetD67_1: D67.1(A) SW29.1
NetD68_1: D68.1(A) SW30.1
NetD69_1: D69.1(A) SW31.1
NetD70_1: D70.1(A) SW32.1
NetD71_1: D71.1(A) SW33.1
NetD72_1: D72.1(A) SW34.1
NetD73_1: D73.1(A) SW35.1
NetD74_1: D74.1(A) SW36.1
NetD75_1: D75.1(A) SW37.1
NetD76_1: D76.1(A) SW38.1
NetD77_1: D77.1(A) SW39.1
NetD78_1: D78.1(A) SW40.1
NetD79_1: D79.1(A) SW41.1
NetD85_1: D85.1(A) SW42.1
NetD86_1: D86.1(A) SW43.1
NetD87_1: D87.1(A) SW44.1
NetD88_1: D88.1(A) SW45.1
NetD89_1: D89.1(A) SW46.1
NetD90_1: D90.1(A) SW47.1
NetD91_1: D91.1(A) SW48.1
NetD92_1: D92.1(A) SW49.1
NetD93_1: D93.1(A) SW50.1
NetD94_1: D94.1(A) SW51.1
NetD95_1: D95.1(A) SW52.1
NetD96_1: D96.1(A) SW53.1
NetD97_1: D97.1(A) SW54.1
NetD98_1: D98.1(A) SW55.1
NetD99_1: D99.1(A) SW56.1
NetD110_1: D110.1(A) SW57.1
NetD111_1: D111.1(A) SW58.1
NetD112_1: D112.1(A) SW59.1
NetD113_1: D113.1(A) SW60.1
NetD114_1: D114.1(A) SW61.1
NetD115_1: D115.1(A) SW62.1
NetD116_1: D116.1(A) SW63.1
NetD117_1: D117.1(A) SW64.1
NetD118_1: D118.1(A) SW65.1
NetD119_1: D119.1(A) SW66.1
NetD120_1: D120.1(A) SW67.1
NetD121_1: D121.1(A) SW68.1
NetD122_1: D122.1(A) SW69.1
NetD123_1: D123.1(A) SW70.1
NetD124_1: D124.1(A) SW71.1
NetD125_1: D125.1(A) SW72.1
NetD136_1: D136.1(A) SW73.1
NetD137_1: D137.1(A) SW74.1
NetD138_1: D138.1(A) SW75.1
NetD139_1: D139.1(A) SW76.1
NetD140_1: D140.1(A) SW77.1
NetD141_1: D141.1(A) SW78.1
NetD142_1: D142.1(A) SW79.1
NetD143_1: D143.1(A) SW80.1
NetD144_1: D144.1(A) SW81.1
NetD145_1: D145.1(A) SW82.1
NetD146_1: D146.1(A) SW83.1
NetD147_1: D147.1(A) SW84.1
NetD148_1: D148.1(A) SW85.1
NetD149_1: D149.1(A) SW86.1
NetD150_1: D150.1(A) SW87.1
NetD151_1: D151.1(A) SW88.1
NetD162_1: D162.1(A) SW89.1
NetD163_1: D163.1(A) SW90.1
NetD164_1: D164.1(A) SW91.1
NetD165_1: D165.1(A) SW92.1
NetD166_1: D166.1(A) SW93.1
NetD167_1: D167.1(A) SW94.1
NetD168_1: D168.1(A) SW95.1
NetD169_1: D169.1(A) SW96.1
NetD170_1: D170.1(A) SW97.1
NetD171_1: D171.1(A) SW98.1
NetD172_1: D172.1(A) SW99.1
NetD173_1: D173.1(A) SW100.1
NetD174_1: D174.1(A) SW101.1
NetD175_1: D175.1(A) SW102.1
NetD176_1: D176.1(A) SW103.1
NetD177_1: D177.1(A) SW104.1
NetD221_1: D221.1(A) L1.2 Q18.3(D)
NetR27_2: R27.2 SW89.2 SW90.2 SW91.2 SW92.2 SW93.2 SW94.2 SW95.2 SW96.2 SW97.2 SW98.2 SW99.2 SW100.2 SW101.2 SW102.2 SW103.2 SW104.2
NetR28_2: R28.2 SW73.2 SW74.2 SW75.2 SW76.2 SW77.2 SW78.2 SW79.2 SW80.2 SW81.2 SW82.2 SW83.2 SW84.2 SW85.2 SW86.2 SW87.2 SW88.2
NetR29_2: R29.2 SW57.2 SW58.2 SW59.2 SW60.2 SW61.2 SW62.2 SW63.2 SW64.2 SW65.2 SW66.2 SW67.2 SW68.2 SW69.2 SW70.2 SW71.2 SW72.2
NetR30_2: R30.2 SW42.2 SW43.2 SW44.2 SW45.2 SW46.2 SW47.2 SW48.2 SW49.2 SW50.2 SW51.2 SW52.2 SW53.2 SW54.2 SW55.2 SW56.2
NetR31_2: R31.2 SW29.2 SW30.2 SW31.2 SW32.2 SW33.2 SW34.2 SW35.2 SW36.2 SW37.2 SW38.2 SW39.2 SW40.2 SW41.2
NetR32_2: R32.2 SW16.2 SW17.2 SW18.2 SW19.2 SW20.2 SW21.2 SW22.2 SW23.2 SW24.2 SW25.2 SW26.2 SW27.2 SW28.2
NetR33_2: R33.2 SW2.2 SW3.2 SW4.2 SW5.2 SW6.2 SW7.2 SW8.2 SW9.2 SW10.2 SW11.2 SW12.2 SW13.2 SW14.2 SW15.2 SW105.2

Not connected (* = marked no-connect by the designer): * 3(P6.4/DCD)

## Notes on the sheet
- (near D1) ESC
- (near D2) F1
- (near D3) F2
- (near D4) F3
- (near D9) F4
- (near D10) `~
- (near D11) 1!
- (near D12) 2@
- (near D13) 3#
- (near D14) 4$
- (near D15) TAB
- (near D16) Q
- (near D17) W
- (near D18) E
- (near D19) R
- 0
- 1
- 2
- 3
- 4
- 5
- 6
- 7
- 8
- 9
- +
- -
- *
- /
- (near D5) .
- (near D34) CAPS
- (near D35) A
- (near D36) S
- (near D37) D
- (near D38) F
- (near D39) SHIFT-L
- (near D40) Z
- (near D41) X
- (near D42) C
- (near D43) V
- CTRL-L
- Win-L
- ALT-L
- SPACE
- ALT-R
- Win-R
- FN
- CTRL-R
- LEFT
- DOWN
- RIGHT
- NUM
- ENTER-R
- (near D57) CTRL-L
- (near D58) WIN-L
- (near D59) ALT-L
- (near D60) SPACE
- (near D61) ALT-R
- (near D62) 0
- (near D63) 1
- (near D64) 2
- (near D65) 3
- (near D66) 4
- SHIFT-L
- Z
- X
- C
- V
- B
- N
- M
- ,<
- .>
- /?
- SHIFT-R
- UP
- (near D80) F5
- (near D81) F6
- (near D82) F7
- (near D83) F8
- (near D84) F9
- CAPS
- A
- S
- D
- F
- G
- H
- J
- K
- L
- ;:
- '"
- ENTER-L
- PAGE UP
- PAGE DOWN
- (near D100) 5%
- (near D101) 6^
- (near D102) 7&
- (near D103) 8*
- (near D104) 9(
- (near D105) T
- (near D106) Y
- (near D107) U
- (near D108) I
- (near D109) O
- TAB
- Q
- W
- E
- R
- T
- Y
- U
- I
- O
- P
- [{
- ]}
- \|
- DELETE
- END
- (near D126) G
- (near D127) H
- (near D128) J
- (near D129) K
- (near D130) L
- (near D131) B
- (near D132) N
- (near D133) M
- (near D134) ,<
- (near D135) .>
- `~
- 1!
- 2@
- 3#
- 4$
- 5%
- 6^
- 7&
- 8*
- 9(
- 0)
- -_
- +=
- BACK
- INSERT
- HOME
- (near D152) WIN-R
- (near D153) FN
- (near D154) CTRL-R
- (near D157) 5
- (near D158) 6
- (near D159) 7
- (near D160) 8
- (near D161) 9
- ESC
- F1
- F2
- F3
- F4
- F5
- F6
- F7
- F8
- F9
- F10
- F11
- F12
- PRINT
- SCROLL
- PAUSE
- (near D178) F10
- (near D179) F11
- (near D180) F12
- (near D181) PRINT
- (near D182) SCROLL
- (near D189) PAUSE
- (near D183) 0)
- (near D184) -_
- (near D185) +=
- (near D186) BACK
- (near D187) INSERT
- (near D193) P
- (near D194) [{
- (near D195) ]}
- (near D196) \|
- (near D197) DELETE
- (near D205) /?
- (near D206) SHIFT-R
- (near D207) UP
- P6.4-DCO @CH557L
- (near D212) LEFT
- (near D213) DOWN
- (near D214) RIGHT
- (near D209) NUM
- (near D222) ENTER-R
- (near D217) +
- (near D218) -
- (near D219) *
- (near D220) /
- (near D215) .

## Library data of the parts
C1 C3-C6 C11 = CAP: Capacitor
  C1: Value: 2.2uF
  C4: Value: 1uF
C9 = Pro336.TMP_100u_11
D5 D20-D33 D44-D56 D67-D79 D85-D99 D110-D125 D136-D151 D162-D177 D221 = DIODE
L1 = INDUCTOR2
P2 = USB: USB Port
Q2-Q17 = PMOS: P-MOSFET
Q18 = NMOS: N-MOSFET
R1-R16 R19-R33 = Res2: Resistor; Value: 3.3K; Published: 8-Jun-2000; LatestRevisionDate: 17-Jul-2002; LatestRevisionNote: Re-released for DXP Platform.; PackageReference: AXIAL-0.4; Publisher: Altium Limited
R312 = DZ
SW1-SW105 = Pro1BB.tmp_UnNamed_18